# EAGLE schematic Nusbio 2 - IC2 Extension (EAGLE 9.6.2)
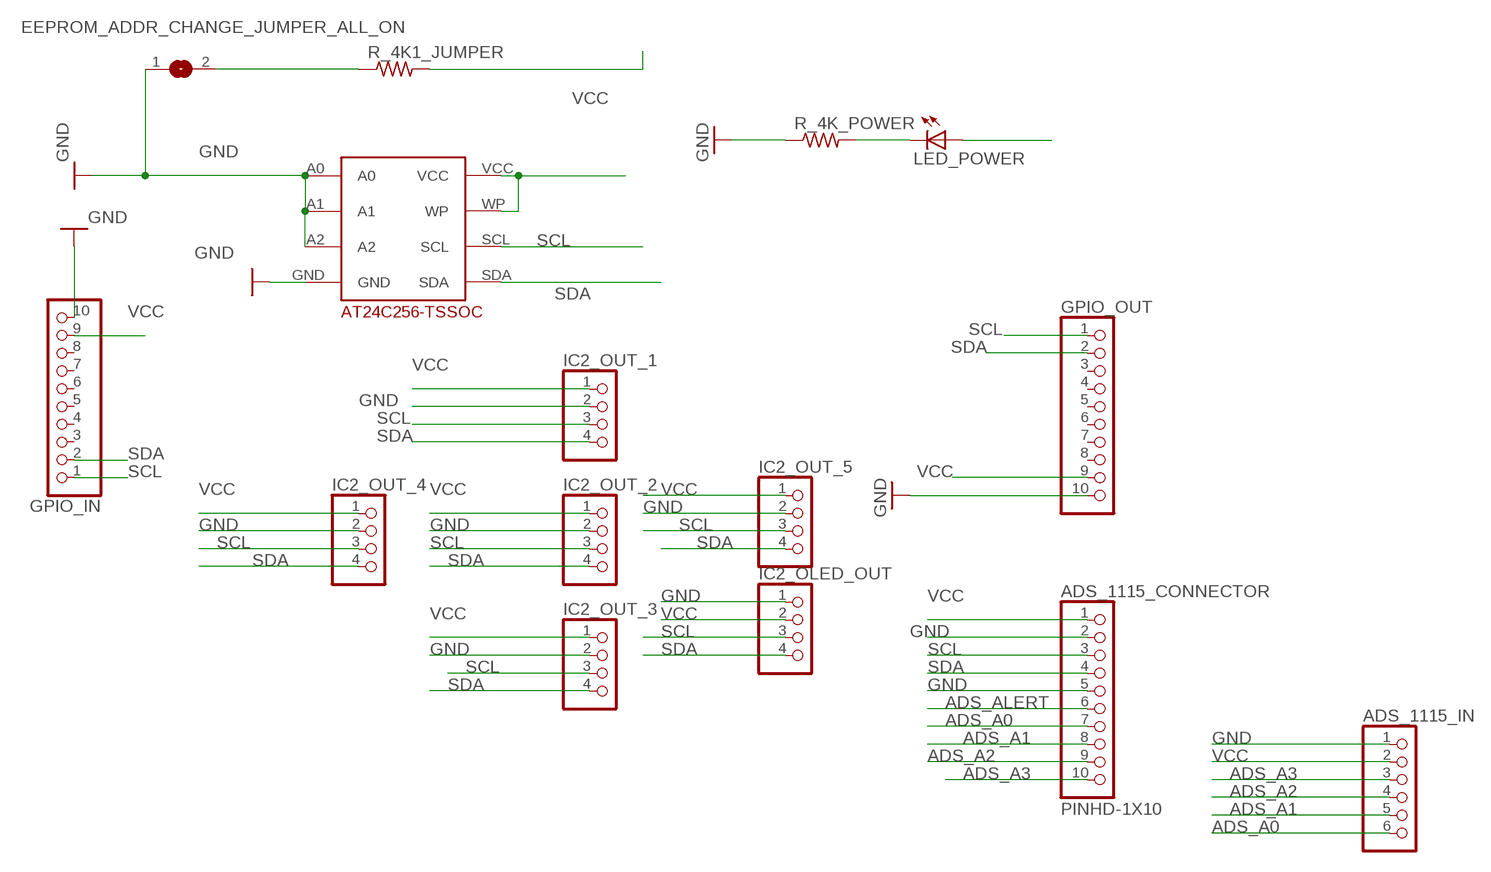
[diagram p0: schematic, sheet 1]

## Parts
ADS_1115_CONNECTOR  PINHD-1X10  [1X10-BIG]
ADS_1115_IN  PINHD-1X6  [1X06]
EEPROM_ADDR_CHANGE_JUMPER_ALL_ON  SOLDERJUMPERREFLOW  [SOLDERJUMPER_REFLOW]
EEPROM_AT24C256  DECADE-AT24C256-10TI-2.7  [DECADE-AT24CXX]
GPIO_IN  PINHD-1X10  [1X10-BIG]
GPIO_OUT  PINHD-1X10  [1X10-BIG]
IC2_OLED_OUT  PINHD-1X4  [1X04]
IC2_OUT_1  PINHD-1X4  [1X04]
IC2_OUT_2  PINHD-1X4  [1X04]
IC2_OUT_3  PINHD-1X4  [1X04]
IC2_OUT_4  PINHD-1X4  [1X04]
IC2_OUT_5  PINHD-1X4  [1X04]
LED_POWER  LEDSMT1206  [1206]
R_4K1_JUMPER  R-US_R1206  [R1206]
R_4K_POWER  R-US_R1206  [R1206]

## Nets
ADS_A0: ADS_1115_CONNECTOR.7 ADS_1115_IN.6
ADS_A1: ADS_1115_CONNECTOR.8 ADS_1115_IN.5
ADS_A2: ADS_1115_CONNECTOR.9 ADS_1115_IN.4
ADS_A3: ADS_1115_CONNECTOR.10 ADS_1115_IN.3
ADS_ALERT: ADS_1115_CONNECTOR.6
GND: ADS_1115_CONNECTOR.2 ADS_1115_CONNECTOR.5 ADS_1115_IN.1 EEPROM_ADDR_CHANGE_JUMPER_ALL_ON.1 EEPROM_AT24C256.A0 EEPROM_AT24C256.A1 EEPROM_AT24C256.A2 EEPROM_AT24C256.GND GPIO_IN.10 GPIO_OUT.10 IC2_OLED_OUT.1 IC2_OUT_1.2 IC2_OUT_2.2 IC2_OUT_3.2 IC2_OUT_4.2 IC2_OUT_5.2 R_4K_POWER.1
N$1: EEPROM_AT24C256.VCC EEPROM_AT24C256.WP
N$2: LED_POWER.C R_4K_POWER.2
N$6: EEPROM_ADDR_CHANGE_JUMPER_ALL_ON.2 R_4K1_JUMPER.1
SCL: ADS_1115_CONNECTOR.3 EEPROM_AT24C256.SCL GPIO_IN.1 GPIO_OUT.1 IC2_OLED_OUT.3 IC2_OUT_1.3 IC2_OUT_2.3 IC2_OUT_3.3 IC2_OUT_4.3 IC2_OUT_5.3
SDA: ADS_1115_CONNECTOR.4 EEPROM_AT24C256.SDA GPIO_IN.2 GPIO_OUT.2 IC2_OLED_OUT.4 IC2_OUT_1.4 IC2_OUT_2.4 IC2_OUT_3.4 IC2_OUT_4.4 IC2_OUT_5.4
VCC: ADS_1115_CONNECTOR.1 ADS_1115_IN.2 GPIO_IN.9 GPIO_OUT.9 IC2_OLED_OUT.2 IC2_OUT_1.1 IC2_OUT_2.1 IC2_OUT_3.1 IC2_OUT_4.1 IC2_OUT_5.1 LED_POWER.A R_4K1_JUMPER.2
Unconnected: GPIO_IN.3 GPIO_IN.4 GPIO_IN.5 GPIO_IN.6 GPIO_IN.7 GPIO_IN.8 GPIO_OUT.3 GPIO_OUT.4 GPIO_OUT.5 GPIO_OUT.6 GPIO_OUT.7 GPIO_OUT.8

## Library data of the parts
ADS_1115_CONNECTOR GPIO_IN GPIO_OUT = adafruit:PINHD-1X10: Pin header 1x10 0.1" spacing With round pins
ADS_1115_IN = adafruit:PINHD-1X6: PIN HEADER
EEPROM_ADDR_CHANGE_JUMPER_ALL_ON = microbuilder:SOLDERJUMPER: SMD Solder JUMPER Solder the two pads together to create a connection, or remove the solder to break it. REFLOW - Use this footprint for solder paste and reflow ovens. WAVE - Use this footprint for hand-soldering (larger pads). CLOSED - Has a trace between the two pads to ensure it is closed by default. The trace needs to be cut to disable the jumper, and can be closed again by creating a solder bridge between the two pads.
EEPROM_AT24C256 = DECADE-libraries20151104:DECADE-AT24C256-10TI-2.7
IC2_OLED_OUT IC2_OUT_1-IC2_OUT_5 = pinhead:PINHD-1X4: PIN HEADER
LED_POWER = adafruit:LED: LED OSRAM: - CHIPLED LG R971, LG N971, LY N971, LG Q971, LY Q971, LO R971, LY R971 LH N974, LH R974 LS Q976, LO Q976, LY Q976 LO Q996 - Hyper CHIPLED LW Q18S LB Q993, LB Q99A, LB R99A - SideLED LS A670, LO A670, LY A670, LG A670, LP A670 LB A673, LV A673, LT A673, LW A673 LH A674 LY A675 LS A676, LA A676, LO A676, LY A676, LW A676 LS A679, LY A679, LG A679 - Hyper Micro SIDELED® LS Y876, LA Y876, LO Y876, LY Y876 LT Y87S - SmartLED LW L88C, LW L88S LB L89C, LB L89S, LG L890 LS L89K, LO L89K, LY L89K LS L896, LA L896, LO L896, LY L896 - TOPLED LS T670, LO T670, LY T670, LG T670, LP T670 LSG T670, LSP T670, LSY T670, LOP T670, LYG T670 LG T671, LOG T671, LSG T671 LB T673, LV T673, LT T673, LW T673 LH T674 LS T676, LA T676, LO T676, LY T676, LB T676, LH T676, LSB T676, LW T676 LB T67C, LV T67C, LT T67C, LS T67K, LO T67K, LY T67K, LW E67C LS E67B, LA E67B, LO E67B, LY E67B, LB E67C, LV E67C, LT E67C LW T67C LS T679, LY T679, LG T679 LS T770, LO T770, LY T770, LG T770, LP T770 LB T773, LV T773, LT T773, LW T773 LH T774 LS E675, LA E675, LY E675, LS T675 LS T776, LA T776, LO T776, LY T776, LB T776 LHGB T686 LT T68C, LB T68C - Hyper Mini TOPLED® LB M676 - Mini TOPLED Santana® LG M470 LS M47K, LO M47K, LY M47K Source: http://www.osram.convergy.de/
R_4K1_JUMPER R_4K_POWER = adafruit:R-US_: RESISTOR, American symbol